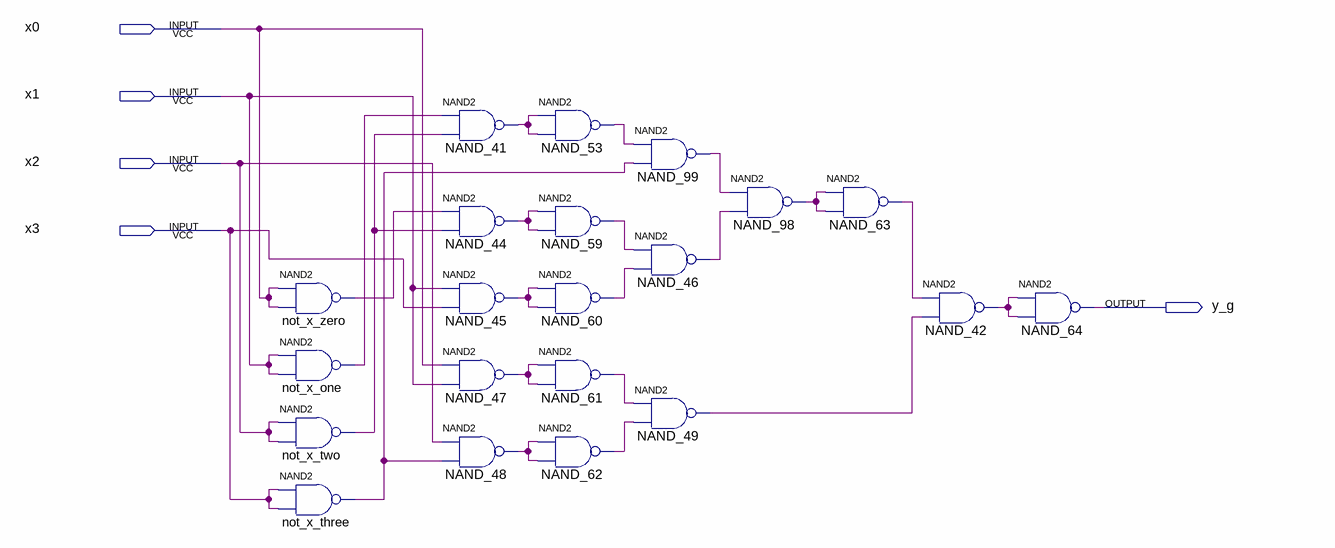
[diagram p0: schematic sheet]
// Quartus schematic g_schema.bdf as structural Verilog: 21 symbols, 5 pins
module g_schema (
  input  x0,
  input  x1,
  input  x2,
  input  x3,
  output y_g
);

  wire NAND_41_out, NAND_42_out, NAND_44_out, NAND_45_out, NAND_46_out, NAND_47_out, NAND_48_out,
       NAND_49_out, NAND_53_out, NAND_59_out, NAND_60_out, NAND_61_out, NAND_62_out, NAND_63_out,
       NAND_98_out, NAND_99_out, not_x_one_out, not_x_three_out, not_x_two_out, not_x_zero_out;

  nand not_x_zero (not_x_zero_out, x0, x0);
  nand not_x_one (not_x_one_out, x1, x1);
  nand not_x_two (not_x_two_out, x2, x2);
  nand not_x_three (not_x_three_out, x3, x3);
  nand NAND_41 (NAND_41_out, not_x_one_out, not_x_two_out);
  nand NAND_44 (NAND_44_out, not_x_zero_out, not_x_two_out);
  nand NAND_45 (NAND_45_out, x1, x3);
  nand NAND_47 (NAND_47_out, x0, x1);
  nand NAND_48 (NAND_48_out, x2, not_x_three_out);
  nand NAND_53 (NAND_53_out, NAND_41_out, NAND_41_out);
  nand NAND_59 (NAND_59_out, NAND_44_out, NAND_44_out);
  nand NAND_60 (NAND_60_out, NAND_45_out, NAND_45_out);
  nand NAND_61 (NAND_61_out, NAND_47_out, NAND_47_out);
  nand NAND_62 (NAND_62_out, NAND_48_out, NAND_48_out);
  nand NAND_99 (NAND_99_out, NAND_53_out, not_x_three_out);
  nand NAND_46 (NAND_46_out, NAND_59_out, NAND_60_out);
  nand NAND_49 (NAND_49_out, NAND_61_out, NAND_62_out);
  nand NAND_98 (NAND_98_out, NAND_99_out, NAND_46_out);
  nand NAND_63 (NAND_63_out, NAND_98_out, NAND_98_out);
  nand NAND_42 (NAND_42_out, NAND_63_out, NAND_49_out);
  nand NAND_64 (y_g, NAND_42_out, NAND_42_out);
endmodule
